# EAGLE design Ex I2C Extension (EAGLE 7.6.0)
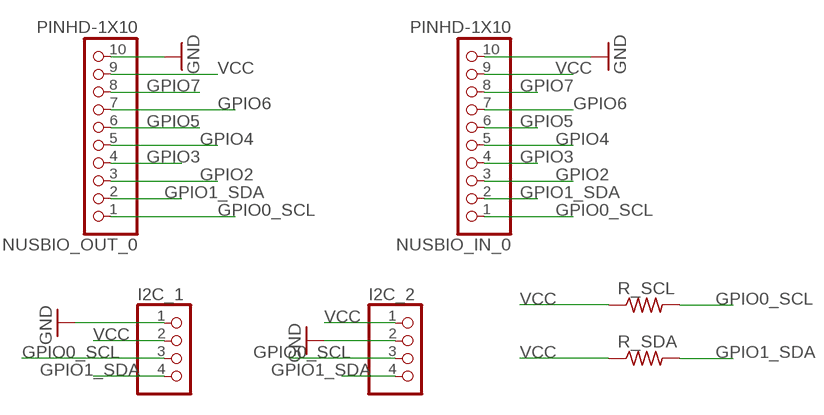
[diagram p0: schematic, sheet 1]

## Parts
I2C_1  PINHD-1X4  [1X04]
I2C_2  PINHD-1X4  [1X04]
NUSBIO_IN_0  PINHD-1X10  [1X10-BIG]
NUSBIO_OUT_0  PINHD-1X10  [1X10-BIG]
R_SCL  R-US_R0805  [R0805]
R_SDA  R-US_R0805  [R0805]

## Nets
GND: I2C_1.1 I2C_2.2 NUSBIO_IN_0.10 NUSBIO_OUT_0.10
GPIO0_SCL: I2C_1.3 I2C_2.3 NUSBIO_IN_0.1 NUSBIO_OUT_0.1 R_SCL.2
GPIO1_SDA: I2C_1.4 I2C_2.4 NUSBIO_IN_0.2 NUSBIO_OUT_0.2 R_SDA.2
GPIO2: NUSBIO_IN_0.3 NUSBIO_OUT_0.3
GPIO3: NUSBIO_IN_0.4 NUSBIO_OUT_0.4
GPIO4: NUSBIO_IN_0.5 NUSBIO_OUT_0.5
GPIO5: NUSBIO_IN_0.6 NUSBIO_OUT_0.6
GPIO6: NUSBIO_IN_0.7 NUSBIO_OUT_0.7
GPIO7: NUSBIO_IN_0.8 NUSBIO_OUT_0.8
VCC: I2C_1.2 I2C_2.1 NUSBIO_IN_0.9 NUSBIO_OUT_0.9 R_SCL.1 R_SDA.1

## Library data of the parts
I2C_1 I2C_2 = pinhead:PINHD-1X4: PIN HEADER
NUSBIO_IN_0 NUSBIO_OUT_0 = adafruit:PINHD-1X10: Pin header 1x10 0.1" spacing With round pins
R_SCL R_SDA = adafruit:R-US_: RESISTOR, American symbol

## Board
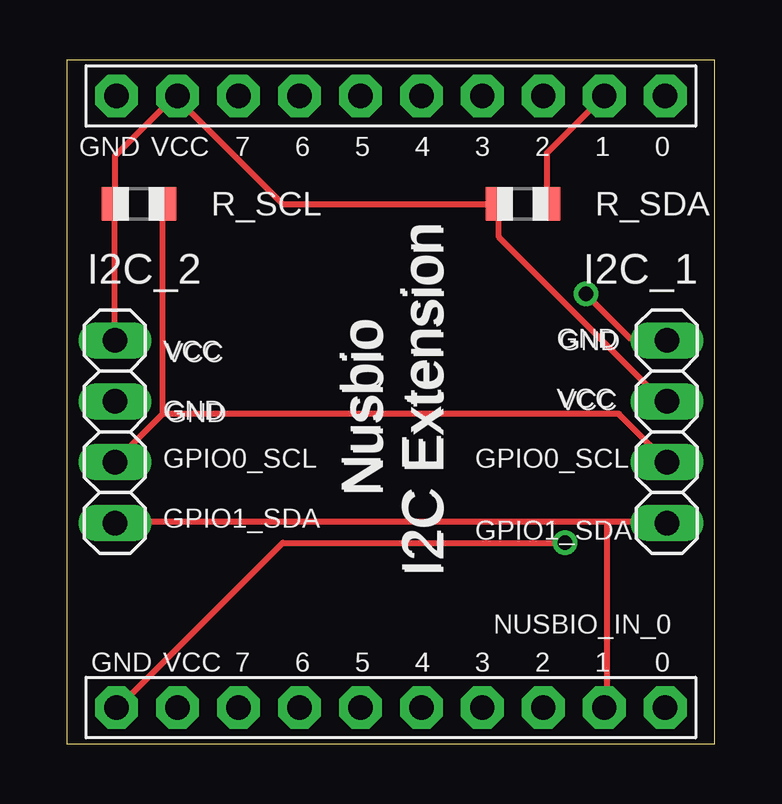
[diagram p1: board, top side]
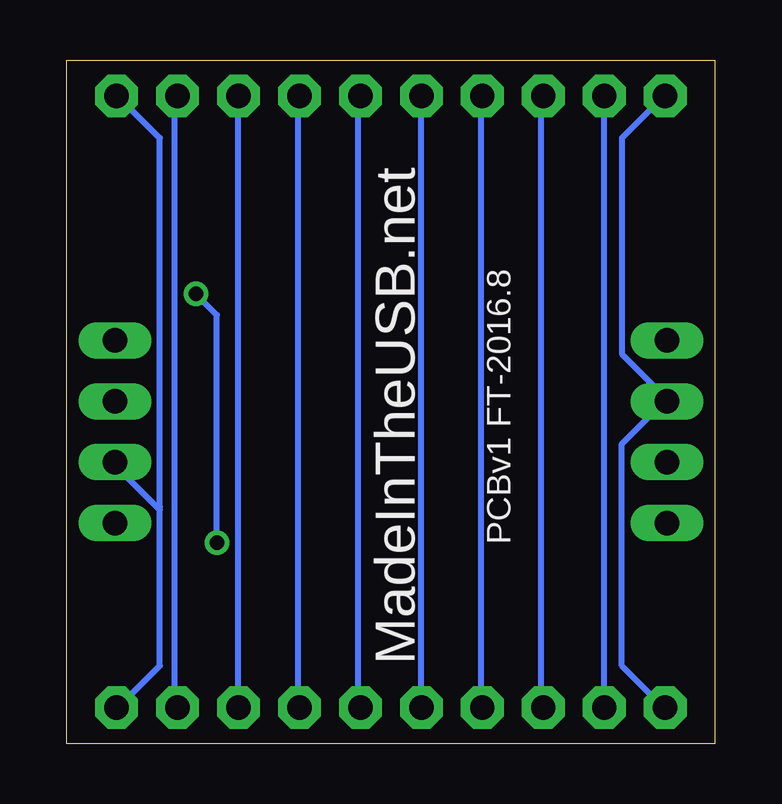
[diagram p2: board, bottom side, seen from below]

Size 27 x 28.5 mm. Coordinates in mm from the lower left corner, seen from the top.
Outline: 0,0 27,0 27,28.5 0,28.5 0,0
Copper layers (1*16): Top 0.035mm / dielectric 1.5mm / Bottom 0.035mm
Design rules "default": minimum track width 10mil, minimum drill 24mil, track to track 8mil, track to pad 8mil, pad to pad 8mil, via to via 8mil, smd to smd 8mil, copper to edge 40mil, drill to drill 8mil, minimum pad ring 10mil, minimum via ring 8mil, stop-mask expansion 4mil, vias tented up to drill 0mil, thermal gap 10mil

### Footprints (pad centres in the part's own frame; a part is rotated, then mirrored left to right if it is on the bottom)
1X04 = drill 1.016 long: 1 -3.81,0; 2 -1.27,0; 3 1.27,0; 4 3.81,0
1X10-BIG = drill 1.016 pad 1.778 octagon: 1 -11.43,0; 2 -8.89,0; 3 -6.35,0; 4 -3.81,0; 5 -1.27,0; 6 1.27,0; 7 3.81,0; 8 6.35,0; 9 8.89,0; 10 11.43,0
R0805 = smd 1.1 x 1.4: 1 -1,0; 2 1,0

### Placement (x,y rotation side)
I2C_1  25,13 270 top
I2C_2  2,13 270 top
NUSBIO_IN_0  13.5,1.5 180 top
NUSBIO_OUT_0  13.5,27 180 top
R_SCL  3,22.5 0 top
R_SDA  19,22.5 0 top

### Tracks (layer width: path | path; a pad name or v marks a point on that pad's centre or on a via)
GND  (via drill 0.61)
  Top 0.254: v21.62,18.75 23.5,16.88 25,16.88 I2C_1.1 | v20.75,8.38 9,8.38 2.12,1.5 NUSBIO_IN_0.10
  Bottom 0.254: NUSBIO_OUT_0.10 2.12,27 3.88,25.25 3.88,16.25 2,14.38 I2C_2.2 2.12,14.25 3.88,12.5 3.88,3.25 2.12,1.5 NUSBIO_IN_0.10 | v21.62,18.75 20.75,17.88 v20.75,8.38
GPIO0_SCL
  Top 0.254: 4,13.75 R_SCL.2 | 4,13.75 2,11.75 I2C_2.3 | 4,13.75 23,13.75 25,11.75 I2C_1.3
  Bottom 0.254: 23.19,9.81 23.12,9.75 23.12,3.25 24.88,1.5 NUSBIO_IN_0.1 | 23.19,9.81 25,11.62 I2C_1.3 | NUSBIO_OUT_0.1 24.88,27 23.12,25.25 23.12,9.88 23.19,9.81
GPIO1_SDA
  Top 0.254: R_SDA.2 20,24.62 22.38,27 NUSBIO_OUT_0.2 | 22.5,9.25 25,9.25 I2C_1.4 | 22.5,9.25 2,9.25 I2C_2.4 | 22.5,9.25 22.5,1.5 NUSBIO_IN_0.2
  Bottom 0.254: NUSBIO_OUT_0.2 22.5,27 22.5,1.5 NUSBIO_IN_0.2
GPIO2
  Bottom 0.254: NUSBIO_IN_0.3 19.88,1.5 19.88,27 NUSBIO_OUT_0.3
GPIO3
  Bottom 0.254: NUSBIO_IN_0.4 17.38,1.5 17.38,27 NUSBIO_OUT_0.4
GPIO4
  Bottom 0.254: NUSBIO_IN_0.5 14.88,1.5 14.88,27 NUSBIO_OUT_0.5
GPIO5
  Bottom 0.254: NUSBIO_IN_0.6 12.25,1.5 12.25,27 NUSBIO_OUT_0.6
GPIO6
  Bottom 0.254: NUSBIO_IN_0.7 9.75,1.5 9.75,27 NUSBIO_OUT_0.7
GPIO7
  Bottom 0.254: NUSBIO_IN_0.8 7.25,1.5 7.25,27 NUSBIO_OUT_0.8
VCC
  Top 0.254: I2C_1.2 25,14.38 24.75,14.38 18,21.12 R_SDA.1 9,22.5 4.62,26.88 NUSBIO_OUT_0.9 4.5,27 2,24.5 R_SCL.1 I2C_2.1
  Bottom 0.254: NUSBIO_IN_0.9 4.62,1.5 4.62,27 NUSBIO_OUT_0.9

### Text on the board
tNames: GND | VCC | 7 | 6 | 5 | 4 | 3 | 2 | 1 | 0 | VCC | VCC | GND | GND | GND | Nusbio / I2C Extension | Nusbio / I2C Extension | VCC | VCC | GND | GPIO0_SCL | GPIO0_SCL | GPIO1_SDA | GPIO1_SDA | GND | VCC | 7 | 6 | 5 | 4 | 3 | 2 | 1 | 0
bNames: PCBv1 FT-2016.8 | MadeInTheUSB.net